# EAGLE design ArduinoUhr_VFD (EAGLE 9.2.1)
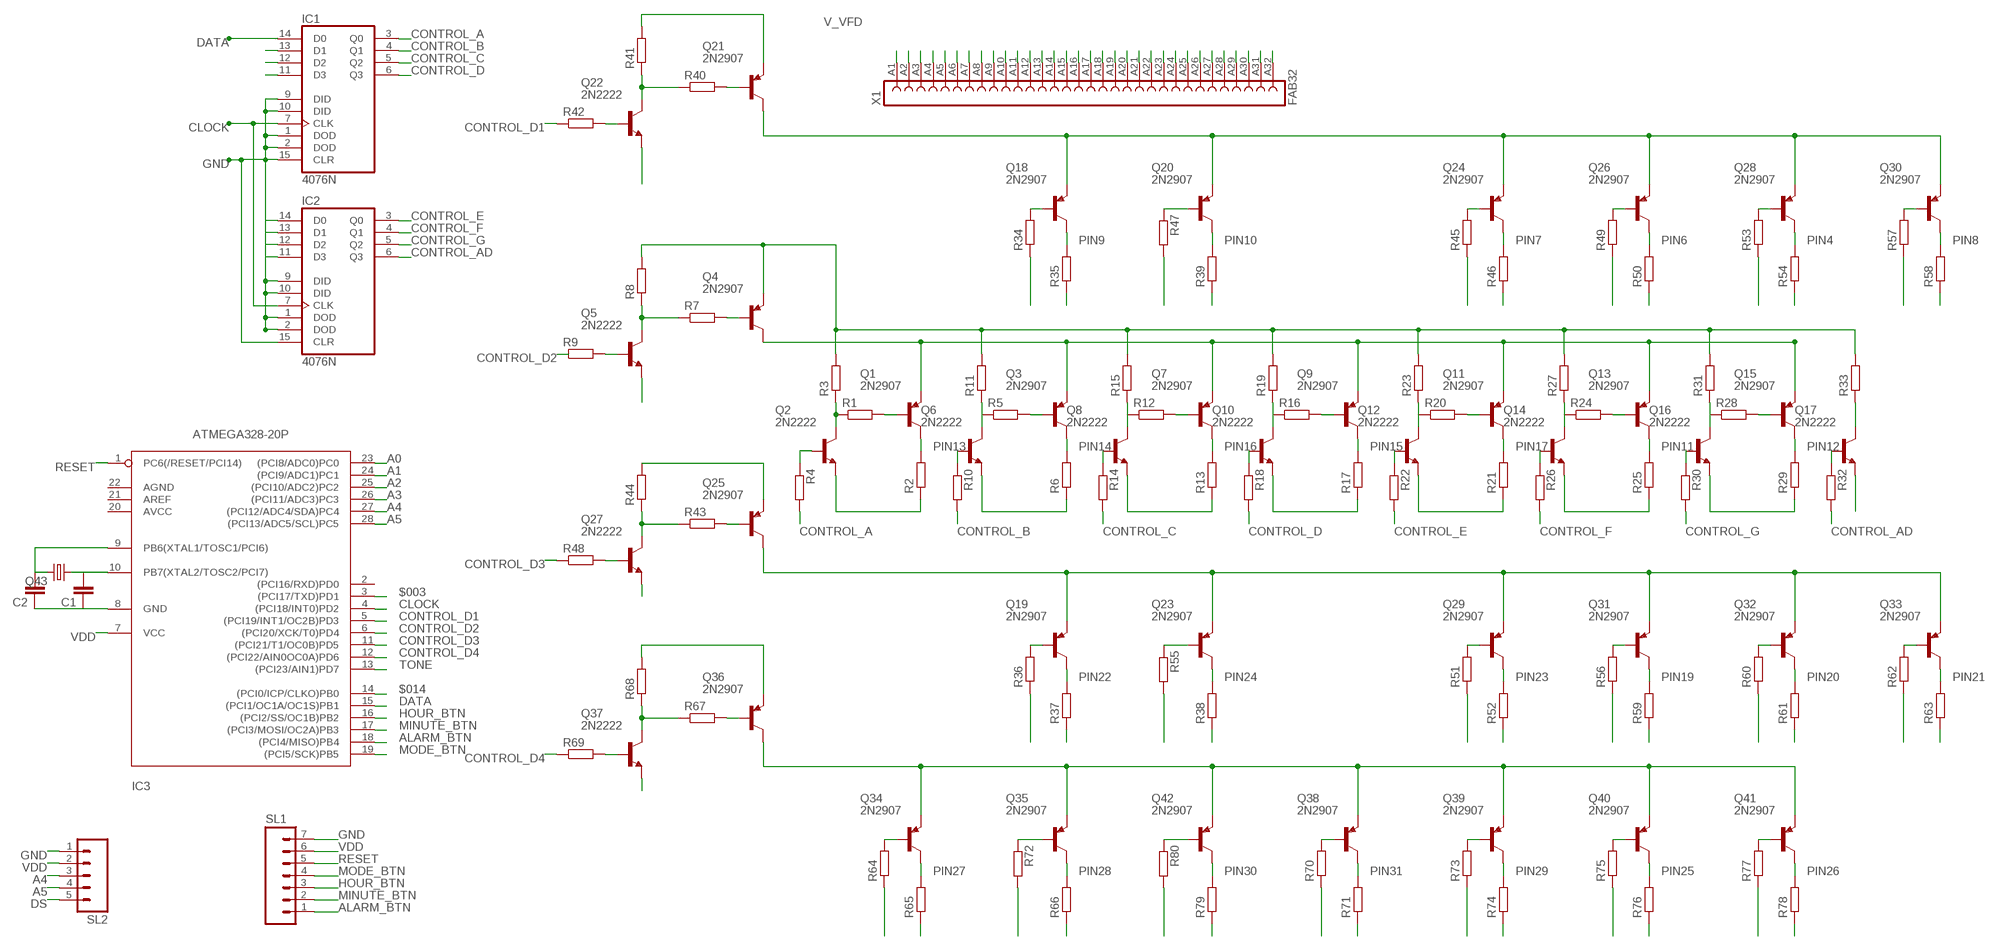
[diagram p0: schematic, sheet 1]

## Parts
C1  C-EU025-024X044  [C025-024X044]
C2  C-EU025-024X044  [C025-024X044]
IC1  4076N  [DIL16]
IC2  4076N  [DIL16]
IC3  ATMEGA328-20P  [DIL28-3]
Q1  2N2907  [TO18]
Q2  2N2222  [TO18]
Q3  2N2907  [TO18]
Q4  2N2907  [TO18]
Q5  2N2222  [TO18]
Q6  2N2222  [TO18]
Q7  2N2907  [TO18]
Q8  2N2222  [TO18]
Q9  2N2907  [TO18]
Q10  2N2222  [TO18]
Q11  2N2907  [TO18]
Q12  2N2222  [TO18]
Q13  2N2907  [TO18]
Q14  2N2222  [TO18]
Q15  2N2907  [TO18]
Q16  2N2222  [TO18]
Q17  2N2222  [TO18]
Q18  2N2907  [TO18]
Q19  2N2907  [TO18]
Q20  2N2907  [TO18]
Q21  2N2907  [TO18]
Q22  2N2222  [TO18]
Q23  2N2907  [TO18]
Q24  2N2907  [TO18]
Q25  2N2907  [TO18]
Q26  2N2907  [TO18]
Q27  2N2222  [TO18]
Q28  2N2907  [TO18]
Q29  2N2907  [TO18]
Q30  2N2907  [TO18]
Q31  2N2907  [TO18]
Q32  2N2907  [TO18]
Q33  2N2907  [TO18]
Q34  2N2907  [TO18]
Q35  2N2907  [TO18]
Q36  2N2907  [TO18]
Q37  2N2222  [TO18]
Q38  2N2907  [TO18]
Q39  2N2907  [TO18]
Q40  2N2907  [TO18]
Q41  2N2907  [TO18]
Q42  2N2907  [TO18]
Q43  CRYSTALHC49S  [HC49/S]
R1  R-EU_0411/3V  [0411V]
R2  R-EU_0204/7  [0204/7]
R3  R-EU_0204/7  [0204/7]
R4  R-EU_0204/7  [0204/7]
R5  R-EU_0204/7  [0204/7]
R6  R-EU_0204/7  [0204/7]
R7  R-EU_0204/2V  [0204V]
R8  R-EU_0204/2V  [0204V]
R9  R-EU_0204/7  [0204/7]
R10  R-EU_0204/7  [0204/7]
R11  R-EU_0204/7  [0204/7]
R12  R-EU_0411/3V  [0411V]
R13  R-EU_0204/7  [0204/7]
R14  R-EU_0204/7  [0204/7]
R15  R-EU_0204/7  [0204/7]
R16  R-EU_0204/7  [0204/7]
R17  R-EU_0204/7  [0204/7]
R18  R-EU_0204/7  [0204/7]
R19  R-EU_0204/7  [0204/7]
R20  R-EU_0411/3V  [0411V]
R21  R-EU_0204/7  [0204/7]
R22  R-EU_0204/7  [0204/7]
R23  R-EU_0204/7  [0204/7]
R24  R-EU_0204/7  [0204/7]
R25  R-EU_0204/7  [0204/7]
R26  R-EU_0204/7  [0204/7]
R27  R-EU_0204/7  [0204/7]
R28  R-EU_0411/3V  [0411V]
R29  R-EU_0204/7  [0204/7]
R30  R-EU_0204/7  [0204/7]
R31  R-EU_0204/7  [0204/7]
R32  R-EU_0204/7  [0204/7]
R33  R-EU_0204/7  [0204/7]
R34  R-EU_0411/3V  [0411V]
R35  R-EU_0204/7  [0204/7]
R36  R-EU_0204/7  [0204/7]
R37  R-EU_0204/7  [0204/7]
R38  R-EU_0204/7  [0204/7]
R39  R-EU_0204/7  [0204/7]
R40  R-EU_0204/2V  [0204V]
R41  R-EU_0204/2V  [0204V]
R42  R-EU_0204/7  [0204/7]
R43  R-EU_0204/2V  [0204V]
R44  R-EU_0204/2V  [0204V]
R45  R-EU_0204/7  [0204/7]
R46  R-EU_0204/7  [0204/7]
R47  R-EU_0204/7  [0204/7]
R48  R-EU_0204/7  [0204/7]
R49  R-EU_0204/7  [0204/7]
R50  R-EU_0204/7  [0204/7]
R51  R-EU_0204/7  [0204/7]
R52  R-EU_0204/7  [0204/7]
R53  R-EU_0411/3V  [0411V]
R54  R-EU_0204/7  [0204/7]
R55  R-EU_0411/3V  [0411V]
R56  R-EU_0204/7  [0204/7]
R57  R-EU_0411/3V  [0411V]
R58  R-EU_0204/7  [0204/7]
R59  R-EU_0204/7  [0204/7]
R60  R-EU_0411/3V  [0411V]
R61  R-EU_0204/7  [0204/7]
R62  R-EU_0411/3V  [0411V]
R63  R-EU_0204/7  [0204/7]
R64  R-EU_0204/7  [0204/7]
R65  R-EU_0204/7  [0204/7]
R66  R-EU_0204/7  [0204/7]
R67  R-EU_0204/2V  [0204V]
R68  R-EU_0204/2V  [0204V]
R69  R-EU_0204/7  [0204/7]
R70  R-EU_0204/7  [0204/7]
R71  R-EU_0204/7  [0204/7]
R72  R-EU_0411/3V  [0411V]
R73  R-EU_0411/3V  [0411V]
R74  R-EU_0204/7  [0204/7]
R75  R-EU_0411/3V  [0411V]
R76  R-EU_0204/7  [0204/7]
R77  R-EU_0204/7  [0204/7]
R78  R-EU_0204/7  [0204/7]
R79  R-EU_0204/7  [0204/7]
R80  R-EU_0204/7  [0204/7]
SL1  M07  [07P]
SL2  M05  [05P]
X1  FAB32  [FAB32]

## Nets
$003: IC3.3((PCI17/TXD)PD1)
$014: IC3.14((PCI0/ICP/CLKO)PB0)
A0: IC3.23((PCI8/ADC0)PC0)
A1: IC3.24((PCI9/ADC1)PC1)
A2: IC3.25((PCI10/ADC2)PC2)
A3: IC3.26((PCI11/ADC3)PC3)
A4: IC3.27((PCI12/ADC4/SDA)PC4) SL2.3
A5: IC3.28((PCI13/ADC5/SCL)PC5) SL2.4
ALARM_BTN: IC3.18((PCI4/MISO)PB4) SL1.1
CI_A: Q2.3(C) R1.1 R3.1 R64.1
CI_AD: Q17.3(C) R33.1 R57.1 R62.1
CI_B: Q6.3(C) R5.1 R11.1 R34.1 R36.1 R72.2
CI_C: Q8.3(C) R12.1 R15.1 R47.2 R55.2 R80.2
CI_D: Q10.3(C) R16.1 R19.1 R70.1
CI_E: Q12.3(C) R20.1 R23.1 R45.1 R51.1 R73.1
CI_F: Q14.3(C) R24.1 R27.1 R49.1 R56.1 R75.1
CI_G: Q16.3(C) R28.1 R31.1 R53.1 R60.1 R77.1
CLOCK: IC1.7(CLK) IC2.7(CLK) IC3.4((PCI18/INT0)PD2)
CONTROL_A: IC1.3(Q0) IC1.13(D1) R4.2
CONTROL_AD: IC2.6(Q3) R32.2
CONTROL_B: IC1.4(Q1) IC1.12(D2) R10.2
CONTROL_C: IC1.5(Q2) IC1.11(D3) R14.2
CONTROL_D: IC1.6(Q3) IC2.14(D0) R18.2
CONTROL_D1: IC3.5((PCI19/INT1/OC2B)PD3) R42.1
CONTROL_D2: IC3.6((PCI20/XCK/T0)PD4) R9.1
CONTROL_D3: IC3.11((PCI21/T1/OC0B)PD5) R48.1
CONTROL_D4: IC3.12((PCI22/AIN0OC0A)PD6) R69.1
CONTROL_E: IC2.3(Q0) IC2.13(D1) R22.2
CONTROL_F: IC2.4(Q1) IC2.12(D2) R26.2
CONTROL_G: IC2.5(Q2) IC2.11(D3) R30.2
DATA: IC1.14(D0) IC3.15((PCI1/OC1A/OC1S)PB1)
DS: SL2.5
GND: C1.1 C2.1 IC1.1(DOD) IC1.2(DOD) IC1.9(DID) IC1.10(DID) IC1.15(CLR) IC2.1(DOD) IC2.2(DOD) IC2.9(DID) IC2.10(DID) IC2.15(CLR) IC3.8(GND) Q2.1(E) Q5.1(E) Q6.1(E) Q8.1(E) Q10.1(E) Q12.1(E) Q14.1(E) Q16.1(E) Q17.1(E) Q22.1(E) Q27.1(E) Q37.1(E) R2.1 R6.1 R13.1 R17.1 R21.1 R25.1 R29.1 R35.1 R37.1 R38.1 R39.1 R46.1 R50.1 R52.1 R54.1 R58.1 R59.1 R61.1 R63.1 R65.1 R66.1 R71.1 R74.1 R76.1 R78.1 R79.1 SL1.7 SL2.1
HOUR_BTN: IC3.16((PCI2/SS/OC1B)PB2) SL1.3
MINUTE_BTN: IC3.17((PCI3/MOSI/OC2A)PB3) SL1.2
MODE_BTN: IC3.19((PCI5/SCK)PB5) SL1.4
N$1: Q5.2(B) R9.2
N$2: Q35.2(B) R72.1
N$3: Q1.2(B) R1.2
N$4: Q42.2(B) R80.1
N$5: Q3.2(B) R5.2
N$6: Q2.2(B) R4.1
N$7: Q4.2(B) R7.2
N$8: Q5.3(C) R7.1 R8.1
N$9: Q18.2(B) R34.2
N$10: Q6.2(B) R10.1
N$11: Q23.2(B) R55.1
N$12: Q20.2(B) R47.1
N$13: Q15.2(B) R28.2
N$14: Q7.2(B) R12.2
N$15: Q21.2(B) R40.2
N$16: Q8.2(B) R14.1
N$17: Q17.2(B) R32.1
N$18: C1.2 IC3.10(PB7(XTAL2/TOSC2/PCI7)) Q43.1
N$19: Q22.3(C) R40.1 R41.1
N$20: Q9.2(B) R16.2
N$21: Q22.2(B) R42.2
N$22: Q10.2(B) R18.1
N$23: C2.2 IC3.9(PB6(XTAL1/TOSC1/PCI6)) Q43.2
N$25: Q16.2(B) R30.1
N$26: Q11.2(B) R20.2
N$28: Q12.2(B) R22.1
N$31: Q24.2(B) R45.2
N$32: Q13.2(B) R24.2
N$34: Q14.2(B) R26.1
N$38: Q26.2(B) R49.2
N$39: Q19.2(B) R36.2
N$41: Q28.2(B) R53.2
N$42: Q25.2(B) R43.2
N$44: Q30.2(B) R57.2
N$45: Q27.3(C) R43.1 R44.1
N$47: Q27.2(B) R48.2
N$50: Q29.2(B) R51.2
N$53: Q31.2(B) R56.2
N$55: Q32.2(B) R60.2
N$57: Q33.2(B) R62.2
N$61: Q34.2(B) R64.2
N$62: Q36.2(B) R67.2
N$63: Q37.3(C) R67.1 R68.1
N$64: Q37.2(B) R69.2
N$67: Q38.2(B) R70.2
N$70: Q39.2(B) R73.2
N$72: Q40.2(B) R75.2
N$74: Q41.2(B) R77.2
PIN1: X1.A1
PIN2: X1.A2
PIN3: X1.A3
PIN4: Q28.3(C) R54.2 X1.A4
PIN5: X1.A5
PIN6: Q26.3(C) R50.2 X1.A6
PIN7: Q24.3(C) R46.2 X1.A7
PIN8: Q30.3(C) R58.2 X1.A8
PIN9: Q18.3(C) R35.2 X1.A9
PIN10: Q20.3(C) R39.2 X1.A10
PIN11: Q13.3(C) R25.2 X1.A11
PIN12: Q15.3(C) R29.2 X1.A12
PIN13: Q1.3(C) R2.2 X1.A13
PIN14: Q3.3(C) R6.2 X1.A14
PIN15: Q9.3(C) R17.2 X1.A15
PIN16: Q7.3(C) R13.2 X1.A16
PIN17: Q11.3(C) R21.2 X1.A17
PIN18: X1.A18
PIN19: Q31.3(C) R59.2 X1.A19
PIN20: Q32.3(C) R61.2 X1.A20
PIN21: Q33.3(C) R63.2 X1.A21
PIN22: Q19.3(C) R37.2 X1.A22
PIN23: Q29.3(C) R52.2 X1.A23
PIN24: Q23.3(C) R38.2 X1.A24
PIN25: Q40.3(C) R76.2 X1.A25
PIN26: Q41.3(C) R78.2 X1.A26
PIN27: Q34.3(C) R65.2 X1.A27
PIN28: Q35.3(C) R66.2 X1.A28
PIN29: Q39.3(C) R74.2 X1.A29
PIN30: Q42.3(C) R79.2 X1.A30
PIN31: Q38.3(C) R71.2 X1.A31
PIN32: X1.A32
RESET: IC3.1(PC6(/RESET/PCI14)) SL1.5
TONE: IC3.13((PCI23/AIN1)PD7)
V_D1: Q18.1(E) Q20.1(E) Q21.3(C) Q24.1(E) Q26.1(E) Q28.1(E) Q30.1(E)
V_D2: Q1.1(E) Q3.1(E) Q4.3(C) Q7.1(E) Q9.1(E) Q11.1(E) Q13.1(E) Q15.1(E)
V_D3: Q19.1(E) Q23.1(E) Q25.3(C) Q29.1(E) Q31.1(E) Q32.1(E) Q33.1(E)
V_D4: Q34.1(E) Q35.1(E) Q36.3(C) Q38.1(E) Q39.1(E) Q40.1(E) Q41.1(E) Q42.1(E)
V_VFD: Q4.1(E) Q21.1(E) Q25.1(E) Q36.1(E) R3.2 R8.2 R11.2 R15.2 R19.2 R23.2 R27.2 R31.2 R33.2 R41.2 R44.2 R68.2
VDD: IC3.7(VCC) SL1.6 SL2.2
Unconnected: IC3.2((PCI16/RXD)PD0) IC3.20(AVCC) IC3.21(AREF) IC3.22(AGND)

## Power pins joined to a net without a drawn wire
VDD: IC1.16(VDD) IC2.16(VDD)
VSS: IC1.8(VSS) IC2.8(VSS)

## Library data of the parts
C1 C2 = rcl:C-EU: CAPACITOR, European symbol; SPICEPREFIX: C
IC1 IC2 = 40xx:4076: Quad D-type REGISTER
IC3 = atmega328:ATMEGA328*P: MICROCONTROLLER 32 kBytes FLASH 2 kBytes SRAM 1 kBytes EEPROM USART 8-channel 10 bit ADC
Q1 Q3 Q4 Q7 Q9 Q11 Q13 Q15 Q18-Q21 Q23-Q26 Q28-Q36 Q38-Q42 = transistor-pnp:2N2907*: PNP Transistor
Q2 Q5 Q6 Q8 Q10 Q12 Q14 Q16 Q17 Q22 Q27 Q37 = transistor-npn:2N2222*: NPN Transistor
Q43 = crystal:CRYSTAL: CRYSTAL; OC_FARNELL: 1667008; OC_NEWARK: unknown
R1 R7 R8 R12 R20 R28 R34 R40 R41 R43 R44 R53 R55 R57 R60 R62 R67 R68 R72 R73 R75 = rcl:R-EU_: RESISTOR, European symbol; SPICEPREFIX: R
R2-R6 R9-R11 R13-R19 R21-R27 R29-R33 R35-R39 R42 R45-R52 R54 R56 R58 R59 R61 R63-R66 R69-R71 R74 R76-R80 = rcl:R-EU_: RESISTOR, European symbol
SL1 = con-amp-quick:M07: AMP QUICK CONNECTOR; OC_FARNELL: unknown; OC_NEWARK: unknown
SL2 = con-amp-quick:M05: AMP QUICK CONNECTOR; OC_FARNELL: unknown; OC_NEWARK: unknown
X1 = con-vg:FAB32: CONNECTOR female, 32 pins, block, type B, row A, grid 2.54 mm

## Net classes
0 default: clearance 0.205 mm

## Board
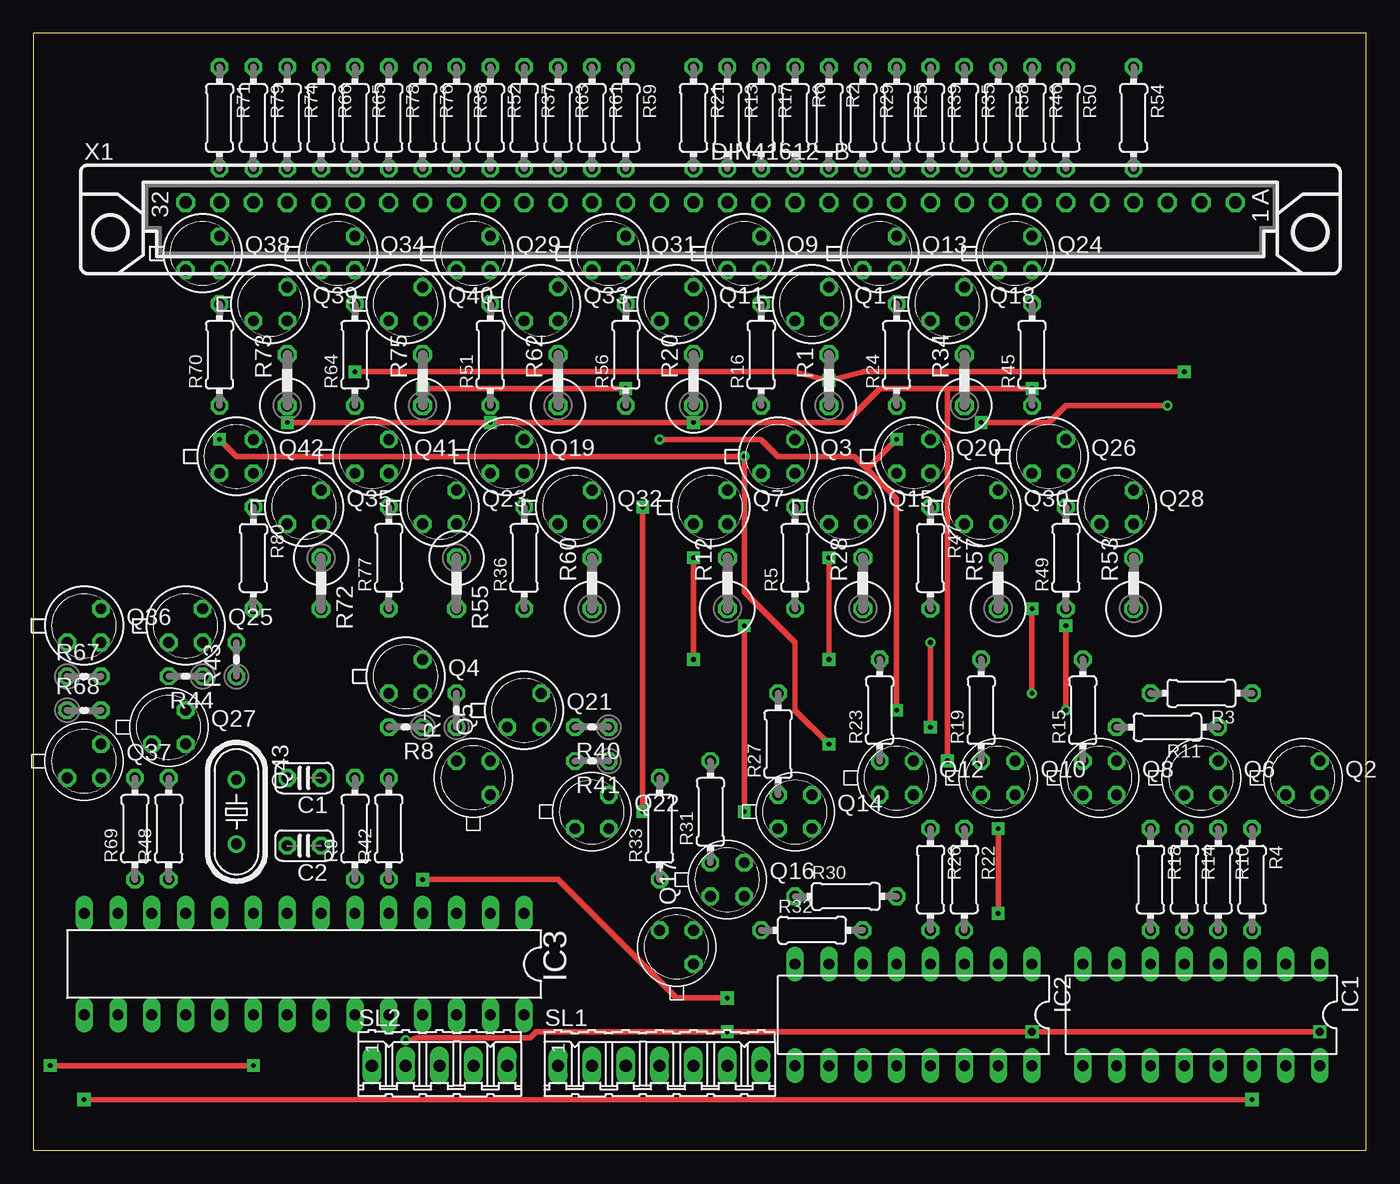
[diagram p1: board, top side]
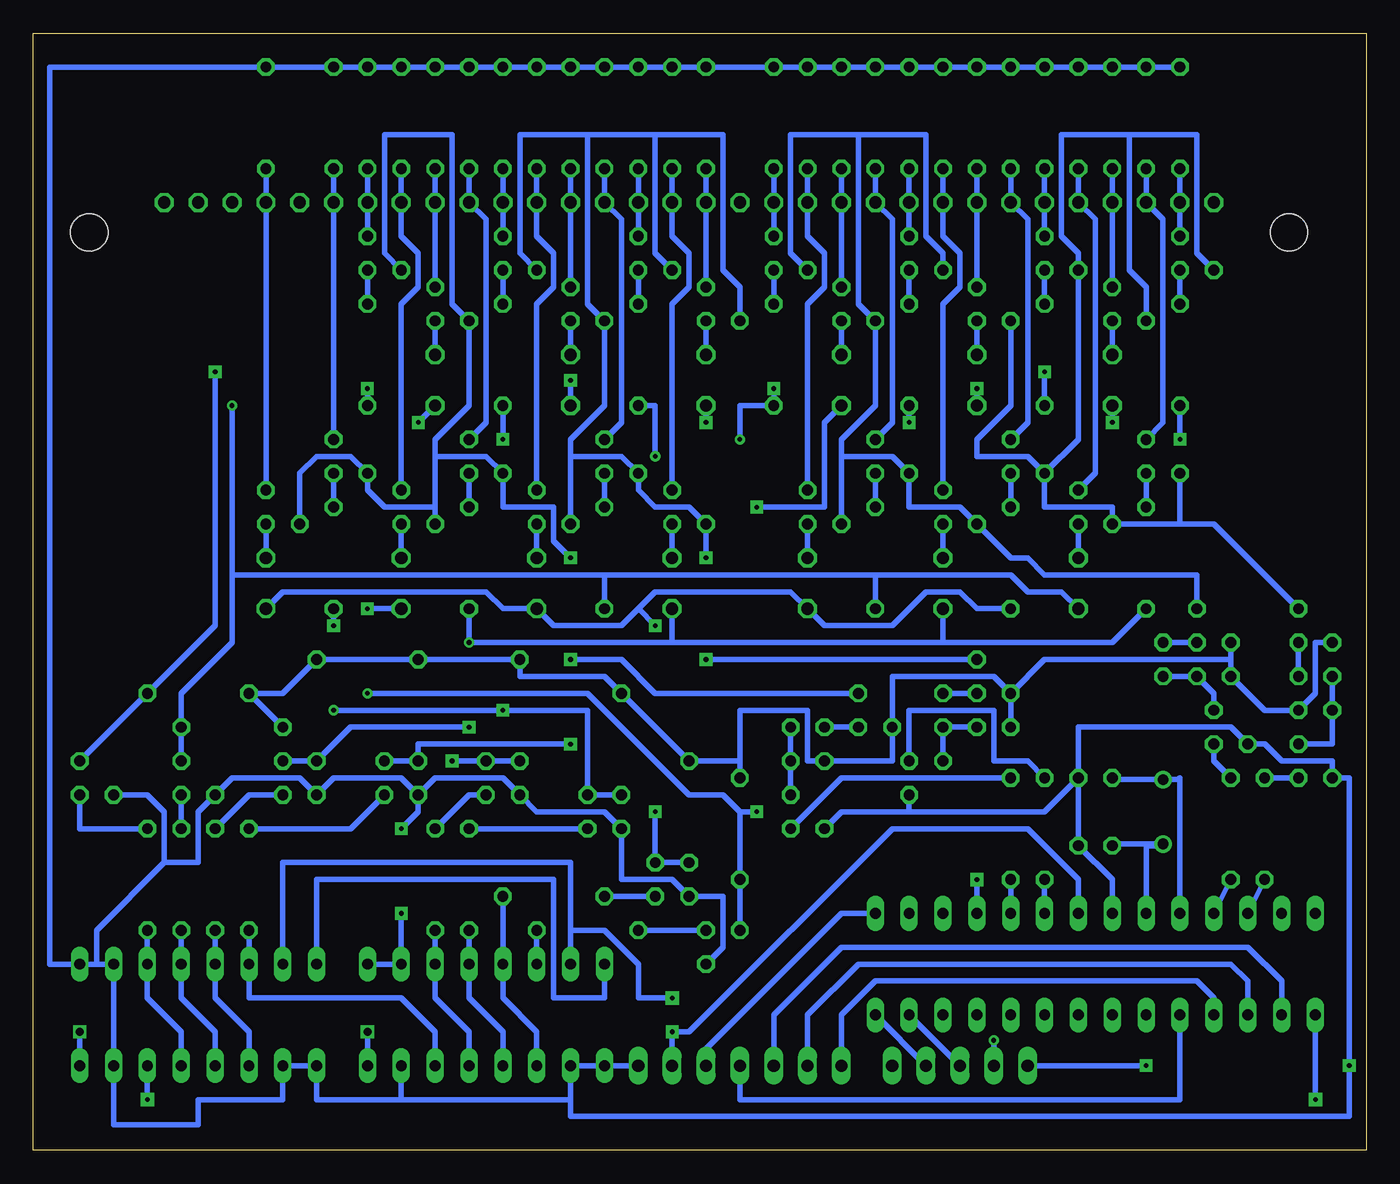
[diagram p2: board, bottom side, seen from below]

Size 100 x 83.81 mm. Coordinates in mm from the lower left corner, seen from the top.
Outline: 0,0 100,0 100,83.81 0,83.81 0,0
Copper layers (1*16): Top 0.035mm / dielectric 1.5mm / Bottom 0.035mm
Design rules "default": minimum track width 10mil, minimum drill 24mil, track to track 8mil, track to pad 8mil, pad to pad 8mil, via to via 8mil, smd to smd 8mil, copper to edge 40mil, drill to drill 8mil, minimum pad ring 10mil, minimum via ring 8mil, stop-mask expansion 4mil, vias tented up to drill 0mil, thermal gap 10mil

### Footprints (pad centres in the part's own frame; a part is rotated, then mirrored left to right if it is on the bottom)
C025-024X044 = drill 0.813 octagon: 1 -1.27,0; 2 1.27,0
DIL16 = drill 0.813 long: 1 -8.89,-3.81; 2 -6.35,-3.81; 3 -3.81,-3.81; 4 -1.27,-3.81; 5 1.27,-3.81; 6 3.81,-3.81; 7 6.35,-3.81; 8 8.89,-3.81; 9 8.89,3.81; 10 6.35,3.81; 11 3.81,3.81; 12 1.27,3.81; 13 -1.27,3.81; 14 -3.81,3.81; 15 -6.35,3.81; 16 -8.89,3.81
DIL28-3 = drill 0.813 long: 1 -16.51,-3.81; 2 -13.97,-3.81; 3 -11.43,-3.81; 4 -8.89,-3.81; 5 -6.35,-3.81; 6 -3.81,-3.81; 7 -1.27,-3.81; 8 1.27,-3.81; 9 3.81,-3.81; 10 6.35,-3.81; 11 8.89,-3.81; 12 11.43,-3.81; 13 13.97,-3.81; 14 16.51,-3.81; 15 16.51,3.81; 16 13.97,3.81; 17 11.43,3.81; 18 8.89,3.81; 19 6.35,3.81; 20 3.81,3.81; 21 1.27,3.81; 22 -1.27,3.81; 23 -3.81,3.81; 24 -6.35,3.81; 25 -8.89,3.81; 26 -11.43,3.81; 27 -13.97,3.81; 28 -16.51,3.81
TO18 = drill 0.813 octagon: 1 -1.27,-1.27; 2 1.27,-1.27; 3 1.27,1.27
HC49/S = drill 0.813: 1 -2.413,0; 2 2.413,0
0411V = drill 0.914 octagon: 1 -2.54,0; 2 1.27,0
0204/7 = drill 0.813 octagon: 1 -3.81,0; 2 3.81,0
0204V = drill 0.813 octagon: 1 -1.27,0; 2 1.27,0
07P = drill 0.914 long: 1 -7.62,0; 2 -5.08,0; 3 -2.54,0; 4 0,0; 5 2.54,0; 6 5.08,0; 7 7.62,0
05P = drill 0.914 long: 1 -5.08,0; 2 -2.54,0; 3 0,0; 4 2.54,0; 5 5.08,0
FAB32 = drill 0.914 octagon: A1 -1.27,39.37; A2 -1.27,36.83; A3 -1.27,34.29; A4 -1.27,31.75; A5 -1.27,29.21; A6 -1.27,26.67; A7 -1.27,24.13; A8 -1.27,21.59; A9 -1.27,19.05; A10 -1.27,16.51; A11 -1.27,13.97; A12 -1.27,11.43; A13 -1.27,8.89; A14 -1.27,6.35; A15 -1.27,3.81; A16 -1.27,1.27; A17 -1.27,-1.27; A18 -1.27,-3.81; A19 -1.27,-6.35; A20 -1.27,-8.89; A21 -1.27,-11.43; A22 -1.27,-13.97; A23 -1.27,-16.51; A24 -1.27,-19.05; A25 -1.27,-21.59; A26 -1.27,-24.13; A27 -1.27,-26.67; A28 -1.27,-29.21; A29 -1.27,-31.75; A30 -1.27,-34.29; A31 -1.27,-36.83; A32 -1.27,-39.37 | hole 2.794: 0.965,-45.009; 0.965,45.009

### Placement (x,y rotation side)
C1  20.32,27.94 180 top
C2  20.32,22.86 180 top
IC1  87.63,10.16 180 top
IC2  66.04,10.16 180 top
IC3  20.32,13.97 180 top
Q1  58.42,63.5 0 top
Q2  95.25,27.94 0 top
Q3  55.88,52.07 0 top
Q4  27.94,35.56 0 top
Q5  33.02,27.94 90 top
Q6  87.63,27.94 0 top
Q7  50.8,48.26 0 top
Q8  80.01,27.94 0 top
Q9  53.34,67.31 0 top
Q10  72.39,27.94 0 top
Q11  48.26,63.5 0 top
Q12  64.77,27.94 0 top
Q13  63.5,67.31 0 top
Q14  57.15,25.4 0 top
Q15  60.96,48.26 0 top
Q16  52.07,20.32 0 top
Q17  48.26,15.24 90 top
Q18  68.58,63.5 0 top
Q19  35.56,52.07 0 top
Q20  66.04,52.07 0 top
Q21  36.83,33.02 0 top
Q22  41.91,25.4 0 top
Q23  30.48,48.26 0 top
Q24  73.66,67.31 0 top
Q25  11.43,39.37 0 top
Q26  76.2,52.07 0 top
Q27  10.16,31.75 0 top
Q28  81.28,48.26 0 top
Q29  33.02,67.31 0 top
Q30  71.12,48.26 0 top
Q31  43.18,67.31 0 top
Q32  40.64,48.26 0 top
Q33  38.1,63.5 0 top
Q34  22.86,67.31 0 top
Q35  20.32,48.26 0 top
Q36  3.81,39.37 0 top
Q37  3.81,29.21 0 top
Q38  12.7,67.31 0 top
Q39  17.78,63.5 0 top
Q40  27.94,63.5 0 top
Q41  25.4,52.07 0 top
Q42  15.24,52.07 0 top
Q43  15.24,25.4 270 top
R1  59.69,58.42 90 top
R2  59.69,77.47 270 top
R3  87.63,34.29 180 top
R4  91.44,20.32 270 top
R5  57.15,44.45 90 top
R6  57.15,77.47 270 top
R7  31.75,33.02 90 top
R8  27.94,31.75 180 top
R9  24.13,24.13 90 top
R10  88.9,20.32 270 top
R11  85.09,31.75 180 top
R12  52.07,43.18 90 top
R13  52.07,77.47 270 top
R14  86.36,20.32 270 top
R15  78.74,33.02 90 top
R16  54.61,59.69 90 top
R17  54.61,77.47 270 top
R18  83.82,20.32 270 top
R19  71.12,33.02 90 top
R20  49.53,58.42 90 top
R21  49.53,77.47 270 top
R22  69.85,20.32 270 top
R23  63.5,33.02 90 top
R24  64.77,59.69 90 top
R25  64.77,77.47 270 top
R26  67.31,20.32 270 top
R27  55.88,30.48 90 top
R28  62.23,43.18 90 top
R29  62.23,77.47 270 top
R30  60.96,19.05 0 top
R31  50.8,25.4 90 top
R32  58.42,16.51 0 top
R33  46.99,24.13 90 top
R34  69.85,58.42 90 top
R35  69.85,77.47 270 top
R36  36.83,44.45 90 top
R37  36.83,77.47 270 top
R38  31.75,77.47 270 top
R39  67.31,77.47 270 top
R40  41.91,31.75 180 top
R41  41.91,29.21 180 top
R42  26.67,24.13 90 top
R43  15.24,36.83 90 top
R44  11.43,35.56 180 top
R45  74.93,59.69 90 top
R46  74.93,77.47 270 top
R47  67.31,44.45 270 top
R48  10.16,24.13 90 top
R49  77.47,44.45 90 top
R50  77.47,77.47 270 top
R51  34.29,59.69 90 top
R52  34.29,77.47 270 top
R53  82.55,43.18 90 top
R54  82.55,77.47 270 top
R55  31.75,41.91 270 top
R56  44.45,59.69 90 top
R57  72.39,43.18 90 top
R58  72.39,77.47 270 top
R59  44.45,77.47 270 top
R60  41.91,43.18 90 top
R61  41.91,77.47 270 top
R62  39.37,58.42 90 top
R63  39.37,77.47 270 top
R64  24.13,59.69 90 top
R65  24.13,77.47 270 top
R66  21.59,77.47 270 top
R67  3.81,35.56 0 top
R68  3.81,33.02 0 top
R69  7.62,24.13 90 top
R70  13.97,59.69 90 top
R71  13.97,77.47 270 top
R72  21.59,41.91 270 top
R73  19.05,58.42 90 top
R74  19.05,77.47 270 top
R75  29.21,58.42 90 top
R76  29.21,77.47 270 top
R77  26.67,44.45 90 top
R78  26.67,77.47 270 top
R79  16.51,77.47 270 top
R80  16.51,44.45 270 top
SL1  46.99,6.35 0 top
SL2  30.48,6.35 0 top
X1  50.8,69.85 270 top

### Tracks (layer width: path | path; a pad name or v marks a point on that pad's centre or on a via)
A4
  Bottom 0.406: SL2.3 IC3.27
A5
  Bottom 0.406: SL2.4 IC3.28
ALARM_BTN
  Bottom 0.406: IC3.18 11.43,11.43 12.7,12.7 36.83,12.7 39.37,10.16 SL1.1
CI_A  (via drill 0.35, 0.35 pad 0.95)
  Top 0.406: v86.36,58.42 62.23,58.42 62.21,58.4 v59.69,57.76 57.17,58.4 57.15,58.42 v24.13,58.42
  Bottom 0.406: Q2.3 R3.1 86.36,39.37 v86.36,58.42 | R1.1 v59.69,57.76 59.69,57.15 | R64.1 v24.13,58.42
CI_AD  (via drill 0.35, 0.35 pad 0.95)
  Top 0.406: v45.72,48.26 v45.72,25.4 | v74.93,34.29 v74.93,40.64
  Bottom 0.406: 46.99,25.4 48.26,26.67 50.8,26.67 58.42,34.29 v74.93,34.29 | R62.1 40.64,54.61 40.64,48.26 v45.72,48.26 | v45.72,25.4 46.99,25.4 | v74.93,40.64 R57.1 | Q17.3 R33.1 46.99,25.4
CI_B  (via drill 0.35, 0.35 pad 0.95)
  Top 0.406: v85.09,55.88 77.47,55.88 76.2,54.61 v71.12,54.61
  Bottom 0.406: Q6.3 R11.1 88.9,34.29 85.09,38.1 85.09,43.18 | R72.2 22.86,41.91 25.4,41.91 26.67,43.18 36.83,43.18 | R36.1 36.83,43.18 | R5.1 57.15,43.18 | 57.15,43.18 36.83,43.18 | 85.09,43.18 v85.09,55.88 | 57.15,43.18 85.09,43.18 | R34.1 v71.12,54.61
CI_C  (via drill 0.35, 0.35 pad 0.95)
  Top 0.406: v67.31,31.75 v67.31,38.1
  Bottom 0.406: Q8.3 R15.1 76.2,31.75 v67.31,31.75 | R80.2 19.05,38.1 31.75,38.1 | R55.2 31.75,38.1 | 52.07,38.1 31.75,38.1 | R12.1 52.07,38.1 | R47.2 v67.31,38.1 52.07,38.1
CI_D  (via drill 0.35, 0.35 pad 0.95)
  Top 0.406: v59.69,30.48 57.15,33.02 57.15,38.1 53.34,41.91 v53.34,52.07 15.24,52.07 v13.97,53.34
  Bottom 0.406: Q10.3 R19.1 71.12,30.48 v59.69,30.48 | v53.34,52.07 53.34,55.88 R16.1 | R70.1 v13.97,53.34
CI_E  (via drill 0.35, 0.35 pad 0.95)
  Top 0.406: 68.58,57.15 63.5,57.15 60.96,54.61 v49.53,54.61 v34.29,54.61 v19.05,54.61 | v68.58,29.21 68.58,57.15 | v74.93,57.15 68.58,57.15
  Bottom 0.406: Q12.3 R23.1 v68.58,29.21 | R73.1 v19.05,54.61 | R51.1 v34.29,54.61 | R20.1 v49.53,54.61 | R45.1 v74.93,57.15
CI_F  (via drill 0.35, 0.35 pad 0.95)
  Top 0.406: v77.47,33.02 v77.47,39.37 | v64.77,33.02 64.77,48.92 62.56,51.13 | v46.99,53.34 54.61,53.34 55.88,52.07 61.62,52.07 62.56,51.13 | v64.77,53.34 62.56,51.13 | v44.45,57.15 v29.21,57.15
  Bottom 0.406: R27.1 Q14.3 58.42,33.02 v64.77,33.02 v77.47,33.02 | v46.99,53.34 46.99,55.88 R56.1 v44.45,57.15 | R49.1 v77.47,39.37 | R24.1 v64.77,53.34 | R75.1 v29.21,57.15
CI_G  (via drill 0.35, 0.35 pad 0.95)
  Top 0.406: v53.34,25.4 v53.34,39.37
  Bottom 0.406: R31.1 Q16.3 v53.34,25.4 | R53.1 81.28,41.91 66.04,41.91 64.77,40.64 R28.1 60.96,39.37 55.88,39.37 54.61,40.64 | R77.1 29.21,40.64 30.48,41.91 33.02,41.91 35.56,39.37 40.64,39.37 R60.1 43.18,41.91 53.34,41.91 54.61,40.64 | v53.34,39.37 54.61,40.64
CLOCK  (via drill 0.35 pad 1)
  Top 0.406: v52.07,11.43 48.26,11.43 39.37,20.32 v29.21,20.32
  Bottom 0.406: IC1.7 81.28,21.59 59.69,21.59 IC2.7 59.69,16.51 57.15,16.51 54.61,13.97 54.61,11.43 v52.07,11.43 | v29.21,20.32 IC3.4
CONTROL_A
  Bottom 0.406: R4.2 IC1.3 91.44,11.43 88.9,8.89 IC1.13
CONTROL_AD
  Bottom 0.406: R32.2 IC2.6
CONTROL_B
  Bottom 0.406: R10.2 IC1.4 88.9,11.43 86.36,8.89 IC1.12
CONTROL_C
  Bottom 0.406: R14.2 IC1.5 86.36,11.43 83.82,8.89 IC1.11
CONTROL_D
  Bottom 0.406: R18.2 IC1.6 83.82,11.43 72.39,11.43 69.85,8.89 IC2.14
CONTROL_D1
  Bottom 0.406: IC3.5 R42.1
CONTROL_D2
  Bottom 0.406: IC3.6 R9.1
CONTROL_D3
  Bottom 0.406: R48.1 IC3.11
CONTROL_D4
  Bottom 0.406: R69.1 IC3.12
CONTROL_E
  Bottom 0.406: IC2.13 67.31,8.89 69.85,11.43 IC2.3 R22.2
CONTROL_F
  Bottom 0.406: IC2.12 64.77,8.89 67.31,11.43 IC2.4 R26.2
CONTROL_G
  Bottom 0.406: IC2.11 62.23,8.89 64.77,11.43 IC2.5 R30.2
DATA  (via drill 0.35, 0.35 pad 0.95, 0.35 pad 1)
  Top 0.406: v3.81,3.81 v91.44,3.81
  Bottom 0.406: IC1.14 v91.44,3.81 | IC3.15 v3.81,3.81
GND  (via drill 0.35, 0.35 pad 0.95)
  Top 0.406: v16.51,6.35 v1.27,6.35 | v72.39,17.78 v72.39,24.13
  Bottom 0.406: 95.25,13.97 IC1.1 98.78,13.97 98.78,81.28 R54.1 R50.1 R46.1 R58.1 R35.1 R39.1 R25.1 R29.1 R2.1 R6.1 R17.1 R13.1 R21.1 R59.1 R61.1 R63.1 R37.1 R52.1 R38.1 R76.1 R78.1 R65.1 R66.1 R74.1 R79.1 R71.1 | 95.25,13.97 IC1.2 IC1.15 93.98,1.91 87.63,1.91 87.63,3.81 81.28,3.81 IC1.10 IC1.9 78.74,3.81 72.39,3.81 | 72.39,3.81 59.69,3.81 | 59.69,3.81 IC2.10 IC2.9 SL1.7 | Q2.1 91.44,26.67 90.17,25.4 90.17,21.59 | 90.17,21.59 95.25,16.51 95.25,13.97 | 90.17,21.59 87.63,21.59 87.63,25.4 Q6.1 85.09,27.94 80.01,27.94 Q8.1 77.47,27.94 72.39,27.94 Q10.1 | Q10.1 69.85,27.94 64.77,27.94 Q12.1 62.23,25.4 57.15,25.4 Q14.1 55.88,20.32 52.07,20.32 Q16.1 48.26,19.05 48.26,15.24 Q17.1 | IC2.15 72.39,3.81 | IC3.8 19.05,20.32 C2.1 C1.1 | C1.1 21.59,31.75 10.16,31.75 Q27.1 7.62,30.48 6.35,29.21 2.54,29.21 Q37.1 1.27,27.94 v1.27,6.35 1.27,2.54 59.69,2.54 59.69,3.81 | C1.1 24.13,25.4 34.29,25.4 | 34.29,25.4 Q5.1 | 34.29,25.4 39.37,25.4 Q22.1 | SL2.1 v16.51,6.35 | IC2.1 IC2.2 v72.39,17.78 | v72.39,24.13 71.12,25.4 Q10.1
HOUR_BTN
  Bottom 0.406: IC3.16 6.35,12.7 8.89,15.24 39.37,15.24 44.45,10.16 SL1.3
MINUTE_BTN
  Bottom 0.406: IC3.17 8.89,12.7 10.16,13.97 38.1,13.97 41.91,10.16 SL1.2
MODE_BTN
  Bottom 0.406: IC3.19 13.97,3.81 46.99,3.81 SL1.4
N$1
  Bottom 0.406: R9.2 25.4,29.21 27.94,29.21 27.94,33.02 34.29,33.02 Q5.2
N$2
  Bottom 0.406: Q35.2 R72.1
N$3
  Bottom 0.406: Q1.2 R1.2
N$4
  Bottom 0.406: Q42.2 R80.1
N$5
  Bottom 0.406: Q3.2 R5.2
N$6
  Bottom 0.406: R4.1 96.52,24.13 Q2.2
N$7
  Bottom 0.406: Q4.2 R7.2
N$8
  Bottom 0.406: Q5.3 R7.1 R8.1
N$9
  Bottom 0.406: Q18.2 R34.2
N$10
  Bottom 0.406: R10.1 Q6.2
N$11
  Bottom 0.406: Q23.2 R55.1
N$12
  Bottom 0.406: Q20.2 R47.1
N$13
  Bottom 0.406: Q15.2 R28.2
N$14
  Bottom 0.406: Q7.2 R12.2
N$15
  Bottom 0.406: R40.2 Q21.2
N$16
  Bottom 0.406: R14.1 83.82,26.67 Q8.2
N$17
  Bottom 0.406: R32.1 Q17.2
N$18
  Bottom 0.406: IC3.10 13.97,27.94 14.1,27.81 Q43.1 18.92,27.81 C1.2
N$19
  Bottom 0.406: R40.1 R41.1 Q22.3
N$20
  Bottom 0.406: Q9.2 R16.2
N$21
  Bottom 0.406: R42.2 39.37,27.94 Q22.2
N$22
  Bottom 0.406: Q10.2 76.2,24.13 R18.1
N$23
  Bottom 0.406: IC3.9 16.51,22.86 15.37,22.86 Q43.2 18.92,22.99 C2.2
N$24  (via drill 0.35 pad 0.95)
  other vias: 59.69,57.78
N$25
  Bottom 0.406: R30.1 Q16.2
N$26
  Bottom 0.406: Q11.2 R20.2
N$28
  Bottom 0.406: R22.1 67.31,26.67 Q12.2
N$31
  Bottom 0.406: Q24.2 R45.2
N$32
  Bottom 0.406: Q13.2 R24.2
N$34
  Bottom 0.406: R26.1 Q14.2
N$38
  Bottom 0.406: Q26.2 R49.2
N$39
  Bottom 0.406: Q19.2 R36.2
N$41
  Bottom 0.406: Q28.2 R53.2
N$42
  Bottom 0.406: Q25.2 R43.2
N$44
  Bottom 0.406: Q30.2 R57.2
N$45
  Bottom 0.406: R43.1 R44.1 11.43,34.29 Q27.3
N$47
  Bottom 0.406: R48.2 11.43,29.21 Q27.2
N$50
  Bottom 0.406: Q29.2 R51.2
N$53
  Bottom 0.406: Q31.2 R56.2
N$55
  Bottom 0.406: Q32.2 R60.2
N$57
  Bottom 0.406: Q33.2 R62.2
N$61
  Bottom 0.406: Q34.2 R64.2
N$62
  Bottom 0.406: R67.2 Q36.2
N$63
  Bottom 0.406: Q37.3 2.54,30.48 R68.1 R67.1
N$64
  Bottom 0.406: R69.2 Q37.2
N$67
  Bottom 0.406: Q38.2 R70.2
N$70
  Bottom 0.406: Q39.2 R73.2
N$72
  Bottom 0.406: Q40.2 R75.2
N$74
  Bottom 0.406: Q41.2 R77.2
PIN4
  Bottom 0.406: R54.2 X1.A4 Q28.3
PIN6
  Bottom 0.406: R50.2 X1.A6 Q26.3
PIN7
  Bottom 0.406: R46.2 X1.A7 Q24.3
PIN8
  Bottom 0.406: R58.2 X1.A8 72.39,68.58 71.12,67.31 71.12,64.77 72.39,63.5 Q30.3
PIN9
  Bottom 0.406: R35.2 X1.A9 Q18.3
PIN10
  Bottom 0.406: R39.2 X1.A10 66.04,69.85 66.04,54.61 Q20.3
PIN11
  Bottom 0.406: R25.2 X1.A11 Q13.3
PIN12
  Bottom 0.406: R29.2 X1.A12 62.23,68.58 60.96,67.31 60.96,64.77 62.23,63.5 Q15.3
PIN13
  Bottom 0.406: R2.2 X1.A13 Q1.3
PIN14
  Bottom 0.406: R6.2 X1.A14 55.88,69.85 55.88,54.61 Q3.3
PIN15
  Bottom 0.406: R17.2 X1.A15 Q9.3
PIN16
  Bottom 0.406: R13.2 X1.A16 52.07,68.58 50.8,67.31 50.8,64.77 52.07,63.5 Q7.3
PIN17
  Bottom 0.406: R21.2 X1.A17 Q11.3
PIN19
  Bottom 0.406: R59.2 X1.A19 Q31.3
PIN20
  Bottom 0.406: R61.2 X1.A20 41.91,68.58 40.64,67.31 40.64,64.77 41.91,63.5 Q32.3
PIN21
  Bottom 0.406: R63.2 X1.A21 Q33.3
PIN22
  Bottom 0.406: R37.2 X1.A22 35.56,69.85 35.56,54.61 Q19.3
PIN23
  Bottom 0.406: R52.2 X1.A23 Q29.3
PIN24
  Bottom 0.406: R38.2 X1.A24 31.75,68.58 30.48,67.31 30.48,64.77 31.75,63.5 Q23.3
PIN25
  Bottom 0.406: R76.2 X1.A25 Q40.3
PIN26
  Bottom 0.406: R78.2 X1.A26 25.4,69.85 25.4,54.61 Q41.3
PIN27
  Bottom 0.406: R65.2 X1.A27 Q34.3
PIN28
  Bottom 0.406: R66.2 X1.A28 20.32,69.85 20.32,50.8 Q35.3
PIN29
  Bottom 0.406: R74.2 X1.A29 Q39.3
PIN30
  Bottom 0.406: R79.2 X1.A30 15.24,69.85 15.24,54.61 Q42.3
PIN31
  Bottom 0.406: R71.2 X1.A31 Q38.3
RESET
  Bottom 0.406: IC3.1 39.37,17.78 49.53,7.62 SL1.5
V_D1  (via drill 0.35, 0.35 pad 0.95)
  Top 0.406: v59.69,36.83 v59.69,44.45
  Bottom 0.406: Q24.1 73.66,67.31 73.66,76.2 68.58,76.2 68.58,63.5 Q18.1 67.31,55.88 69.85,53.34 69.85,52.07 | 69.85,52.07 69.85,48.26 | 69.85,48.26 Q30.1 | 69.85,52.07 66.04,52.07 Q20.1 64.77,48.26 60.96,48.26 60.96,45.72 v59.69,44.45 | 69.85,48.26 73.66,48.26 74.93,49.53 Q26.1 76.2,52.07 78.74,52.07 80.01,50.8 Q28.1 | Q21.3 53.34,34.29 55.88,36.83 v59.69,36.83
V_D2  (via drill 0.35, 0.35 pad 0.95)
  Top 0.406: v49.53,44.45 v49.53,36.83
  Bottom 0.406: Q11.1 46.99,64.77 48.26,66.04 48.26,76.2 53.34,76.2 | 53.34,76.2 53.34,67.31 Q9.1 | 58.42,76.2 58.42,63.5 Q1.1 57.15,55.88 59.69,53.34 59.69,52.07 | 58.42,76.2 53.34,76.2 | Q13.1 63.5,67.31 63.5,76.2 58.42,76.2 | Q4.3 v49.53,36.83 | 59.69,52.07 Q15.1 | 59.69,52.07 55.88,52.07 Q3.1 54.61,49.53 53.34,48.26 50.8,48.26 Q7.1 v49.53,44.45
V_D3
  Bottom 0.406: 38.1,76.2 38.1,63.5 Q33.1 36.83,55.88 39.37,53.34 39.37,52.07 | 38.1,76.2 43.18,76.2 43.18,67.31 Q31.1 | Q29.1 31.75,67.31 33.02,68.58 33.02,76.2 38.1,76.2 | 39.37,52.07 35.56,52.07 Q19.1 34.29,48.26 30.48,48.26 Q23.1 26.67,44.45 25.4,44.45 24.13,43.18 12.7,43.18 Q25.3 | Q32.1 39.37,52.07
V_D4
  Bottom 0.406: Q41.1 24.13,48.26 19.05,48.26 Q35.1 13.97,46.99 | Q41.1 25.4,52.07 29.21,52.07 29.21,53.34 26.67,55.88 Q40.1 | 17.78,76.2 22.86,76.2 22.86,68.58 21.59,67.31 Q34.1 21.59,53.34 Q41.1 | 17.78,76.2 17.78,66.04 16.51,64.77 Q39.1 | Q38.1 12.7,67.31 12.7,76.2 17.78,76.2 | Q42.1 13.97,46.99 | Q36.3 11.43,46.99 13.97,46.99
V_VFD
  Bottom 0.406: R33.2 46.99,29.21 | Q4.1 R8.2 | Q4.1 27.94,35.56 35.56,35.56 Q21.1 35.56,29.21 R41.2 41.91,29.21 41.91,33.02 46.99,33.02 46.99,29.21 | 46.99,29.21 R31.2 R27.2 57.15,35.56 63.5,35.56 R23.2 R19.2 R15.2 81.28,34.29 R3.2 R11.2 | Q36.1 3.81,38.1 3.81,34.29 R68.2 7.62,33.02 R44.2 10.16,36.83 | Q25.1 10.16,36.83 | Q4.1 24.13,36.83 10.16,36.83
VDD  (via drill 0.35, 0.35 pad 0.95, 0.6)
  Top 0.406: v96.52,8.89 v74.93,8.89 v52.07,8.89 37.73,8.89 37.27,8.43 28.77,8.43 28.31,8.25 v27.94,8.25
  Bottom 0.406: IC2.16 v74.93,8.89 | v96.52,8.89 IC1.16 | SL1.6 v52.07,8.89 50.8,8.89 35.56,24.13 25.4,24.13 21.59,20.32 IC3.7 | SL2.2 v27.94,8.25
VSS
  Bottom 0.406: IC1.8 78.74,20.32 60.96,20.32 60.96,11.43 57.15,11.43 IC2.8

### Text on the board
_tNames: R71 | R79 | R74 | R66 | R65 | R78 | R76 | R38 | R52 | R37 | R63 | R61 | R59 | R21 | R13 | R17 | R6 | R2 | R29 | R25 | R39 | R35 | R58 | R46 | R50 | R54 | X1 | Q38 | Q34 | Q29 | Q31 | Q9 | Q13 | Q24 | Q39 | Q40 | Q33 | Q11 | Q1 | Q18 | R70 | R73 | R64 | R75 | R51 | R62 | R56 | R20 | R16 | R1 | R24 | R34 | R45 | Q42 | Q41 | Q19 | Q3 | Q20 | Q26 | Q35 | Q23 | Q32 | Q7 | Q15 | Q30 | Q28 | R80 | R47 | R72 | R55 | R60 | R12 | R28 | R57 | R53 | R77 | R36 | R5 | R49 | Q36 | Q25 | R67 | Q4 | R68 | R44 | R43 | Q21 | R3 | Q27 | Q5 | Q43 | R8 | R7 | R40 | R23 | R19 | R15 | R11 | Q37 | R41 | R27 | Q12 | Q10 | Q8 | Q6 | Q2 | C1 | Q22 | Q14 | R31 | R26 | R22 | R18 | R14 | R10 | R4 | R69 | R48 | C2 | R9 | R42 | R33 | Q16 | R30 | Q17 | R32 | IC3 | IC2 | IC1 | SL2 | SL1